# EAGLE design PCB-JACKGPI (EAGLE 7.1.0)
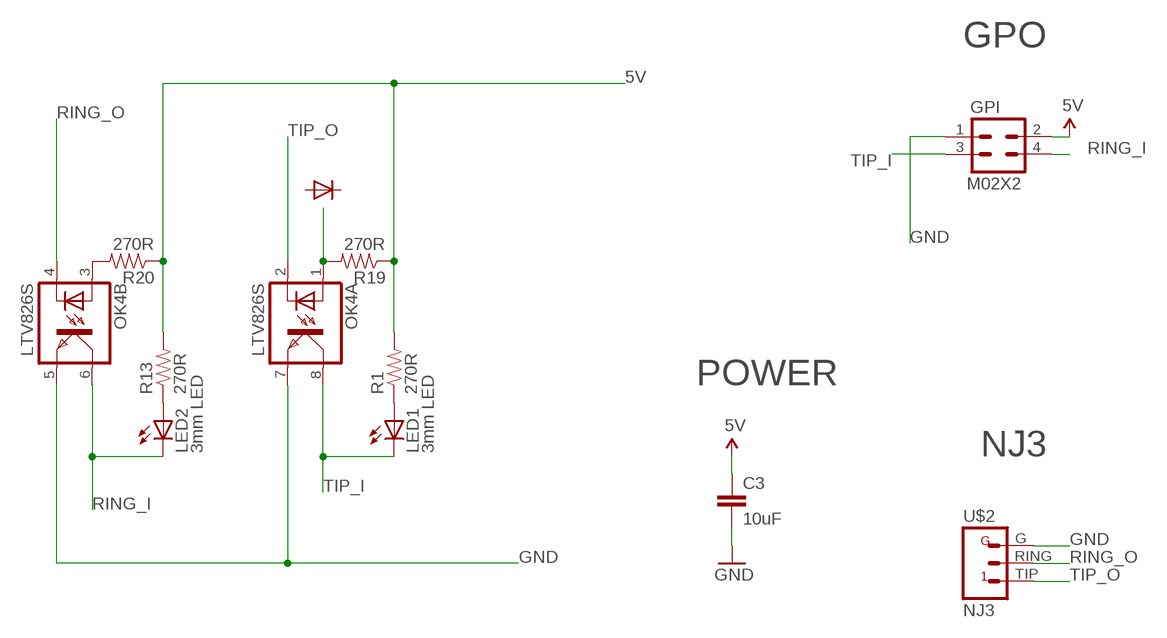
[diagram p0: schematic, sheet 1]

## Parts
C3  10uF  CAP0805  [0805]
GPI  M02X2  [2X2]
LED1  3mm LED  LED3MM  [LED3MM]
LED2  3mm LED  LED3MM  [LED3MM]
OK4  LTV826S  [DIL8-SMD]
R1  270R  RESISTOR0603-RES  [0603-RES]
R13  270R  RESISTOR0603-RES  [0603-RES]
R19  270R  RESISTOR0603-RES  [0603-RES]
R20  270R  RESISTOR0603-RES  [0603-RES]
U$2  NJ3  [NJ3FP6C]

## Nets
5V [PWR]: C3.1 GPI.2 R1.2 R13.2 R19.1 R20.1
GND [PWR]: C3.2 GPI.1 OK4.5(B:EMIT) OK4.7(A:EMIT) U$2.G
N$1: LED1.A R1.1
N$45: LED2.A R13.1
N$56: OK4.1(A:A) R19.2
N$57: OK4.3(B:A) R20.2
RING_I: GPI.4 LED2.K(C) OK4.6(B:COL)
RING_O [RELAY LINES]: OK4.4(B:C) U$2.RING
TIP_I: GPI.3 LED1.K(C) OK4.8(A:COL)
TIP_O [RELAY LINES]: OK4.2(A:C) U$2.TIP

## Notes on the sheet
- GPO
- POWER
- NJ3

## Library data of the parts
C3 = SparkFun:CAP: Capacitor Standard 0603 ceramic capacitor, and 0.1" leaded capacitor.
GPI = SKAARHOJ:M02X2
LED1 LED2 = SparkFun:LED: LEDs Standard schematic elements and footprints for 5mm, 3mm, 1206, and 0603 sized LEDs. 5mm - Spark Fun Electronics SKU : COM-00529 (and others)
OK4 = optocoupler:LTV826: OPTO COUPLER Source: LITEON, LTV816.pdf; OC_FARNELL: unknown; OC_NEWARK: unknown
R1 R13 R19 R20 = SparkFun:RESISTOR: Resistor Basic schematic elements and footprints for 0603, 1206, and PTH resistors.
U$2 = SKAARHOJ:NJ3

## Net classes
0 default: width 0.203 mm, drill 0.406 mm, clearance 0.203 mm
1 PWR: width 0.406 mm, drill 0.61 mm, clearance 0.203 mm
2 RELAY LINES: width 0.406 mm, drill 0.61 mm, clearance 0.203 mm
3 INput lines: width 0.203 mm, drill 0.406 mm, clearance 0.203 mm

## Board
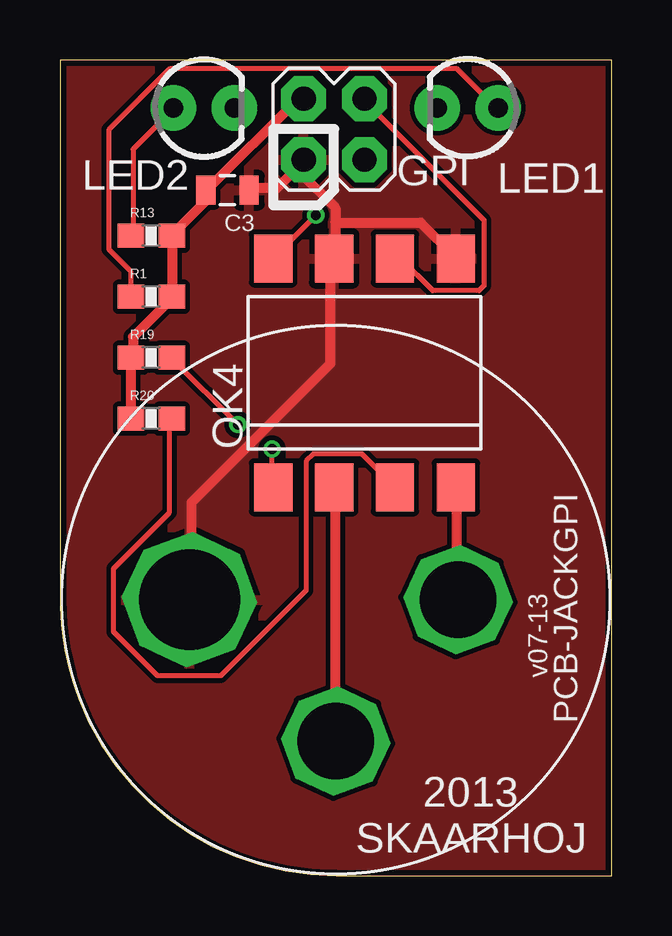
[diagram p1: board, top side]
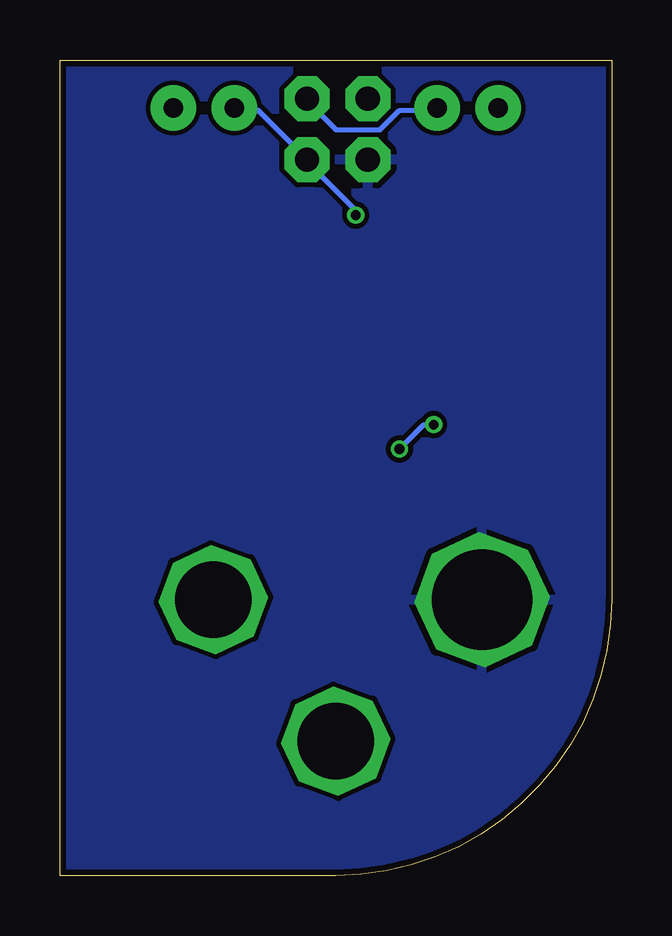
[diagram p2: board, bottom side, seen from below]

Size 23 x 34 mm. Coordinates in mm from the lower left corner, seen from the top.
Outline: 11.5,0 23,0 23,34 0,34 0,11.5 arc90 11.5,0
Copper layers (1*16): Top 0.035mm / dielectric 1.5mm / Bottom 0.035mm
Design rules "Fusion_eagle_rule_v1.1": minimum track width 6mil, minimum drill 12mil, track to track 6mil, track to pad 6mil, pad to pad 6mil, via to via 6mil, smd to smd 0mil, copper to edge 10mil, drill to drill 10mil, minimum pad ring 10mil, minimum via ring 6mil, stop-mask expansion 2mil, vias tented up to drill 100mil, thermal gap 10mil

### Footprints (pad centres in the part's own frame; a part is rotated, then mirrored left to right if it is on the bottom)
0805 = smd 0.8 x 1.2: 1 -0.9,0; 2 0.9,0
2X2 = drill 1.016 pad 1.88 octagon: 1 -3.81,-1.27; 2 -3.81,1.27; 3 -1.27,-1.27; 4 -1.27,1.27
LED3MM = drill 0.813 pad 1.88: A -1.27,0; K 1.27,0
DIL8-SMD = smd 1.6 x 2: 1 -3.81,-4.77; 2 -1.27,-4.77; 3 1.27,-4.77; 4 3.81,-4.77; 5 3.81,4.77; 6 1.27,4.77; 7 -1.27,4.77; 8 -3.81,4.77
0603-RES = smd 1.1 x 1: 1 -0.85,0; 2 0.85,0
NJ3FP6C = drill 4.2 octagon: G -6.1,0 | drill 3.2 octagon: RING 5.1,0; TIP 0,-5.9

### Placement (x,y rotation side)
C3  6.99,28.57 0 top
GPI  13.97,31.11 0 top
LED1  17,32 180 top
LED2  6,32 0 top
OK4  12.7,20.95 0 top
R1  3.81,24.13 0 top
R13  3.81,26.67 0 top
R19  3.81,21.59 0 top
R20  3.81,19.05 0 top
U$2  11.5,11.5 0 top

### Tracks (layer width: path | path; a pad name or v marks a point on that pad's centre or on a via)
5V
  Top 0.406: R20.1 2.95,19.1 2.95,21.54 R19.1 3.05,21.74 3.05,22.45 4.57,23.98 R1.2 4.67,24.18 4.67,26.62 R13.2 4.78,26.82 5.99,28.04 5.99,28.55 C3.1 6.2,28.65 9.86,32.31 10.16,32.31 GPI.2
GND
  Top 0.406: C3.2 7.92,28.65 9.04,28.65 10.16,29.77 GPI.1 9.96,29.36 11.48,27.84 11.48,27.23 | 11.48,27.23 11.48,25.81 OK4.7 11.28,25.6 11.28,21.34 5.49,15.54 5.49,11.58 U$2.G | 11.48,27.23 15.04,27.23 16.46,25.81 OK4.5
  pour Top: 0,0 22.86,0 22.86,34.29 0,34.29
  pour Bottom: 0,0 22.86,0 22.86,34.29 0,34.29
N$1
  Top 0.203: R1.1 2.95,24.18 2.95,25.2 2.03,26.11 2.03,31.09 4.57,33.63 16.56,33.63 18.19,32 LED1.A
N$45
  Top 0.203: R13.1 3.05,26.72 3.05,30.28 4.67,31.9 LED2.A
N$56  (via drill 0.41)
  Top 0.203: v7.42,18.8 4.67,21.54 R19.2 | v8.84,17.78 8.84,16.26 OK4.1
  Bottom 0.203: v7.42,18.8 7.82,18.8 v8.84,17.78
N$57
  Top 0.203: R20.2 4.57,19 4.57,15.14 2.23,12.8 2.23,10.16 4.06,8.33 6.71,8.33 10.26,11.89 10.26,17.27 10.57,17.58 12.6,17.58 13.92,16.26 OK4.3
RING_I
  Top 0.203: OK4.6 14.02,25.7 14.22,25.7 15.54,24.38 17.48,24.38 17.68,24.59 17.68,27.33 12.7,32.31 GPI.4
  Bottom 0.203: LED2.K 7.32,31.9 8.84,31.9 9.65,31.09 11.48,31.09 12.7,32.31 GPI.4
RING_O
  Top 0.406: OK4.4 16.56,16.15 16.56,11.58 U$2.RING
TIP_I  (via drill 0.41)
  Top 0.203: v10.67,27.53 8.94,25.81 OK4.8
  Bottom 0.203: v10.67,27.53 10.67,27.74 12.7,29.77 GPI.3 12.7,29.87 14.73,31.9 15.65,31.9 LED1.K
TIP_O
  Top 0.406: OK4.2 11.48,16.15 11.48,5.69 U$2.TIP

### Text on the board
_tsilk: v07-13 | PCB-JACKGPI | 2013 / SKAARHOJ